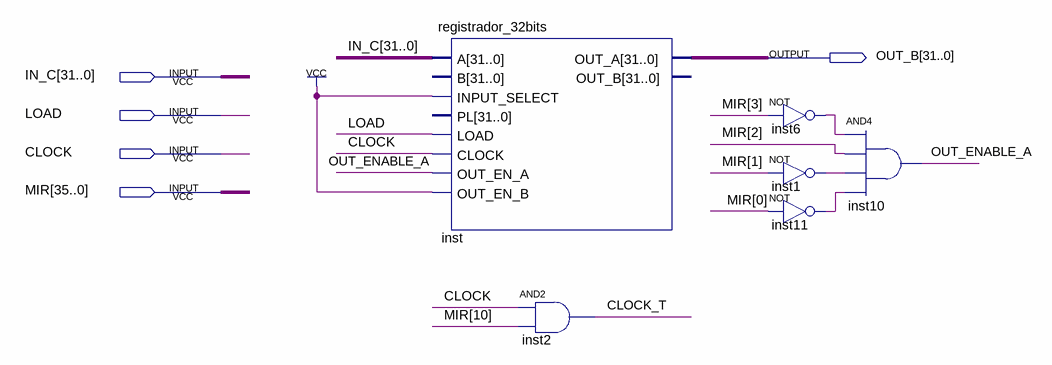
[diagram p0: schematic sheet]
// Quartus schematic SP.bdf as structural Verilog: 6 symbols, 5 pins
module SP (
  input  [31:0] IN_C,
  input  LOAD,
  input  CLOCK,
  input  [35:0] MIR,
  output [31:0] OUT_B
);

  wire CLOCK_T, inst1_out, inst6_out, inst11_out, OUT_ENABLE_A;

  registrador_32bits inst (
    .A(IN_C), .INPUT_SELECT(1'b1), .LOAD(LOAD), .CLOCK(CLOCK), .OUT_EN_A(OUT_ENABLE_A), .OUT_EN_B(1'b1),
    .OUT_A(OUT_B));  // open: B, PL, OUT_B
  and inst2 (CLOCK_T, CLOCK, MIR[10]);
  not inst6 (inst6_out, MIR[3]);
  not inst1 (inst1_out, MIR[1]);
  not inst11 (inst11_out, MIR[0]);
  and inst10 (OUT_ENABLE_A, inst6_out, MIR[2], inst1_out, inst11_out);
endmodule
